# Altium schematic sheet ESP32.SchDoc: MCU & Display
size A4; Engineer: Jason Skells; SheetNumber: 2; SheetTotal: 4
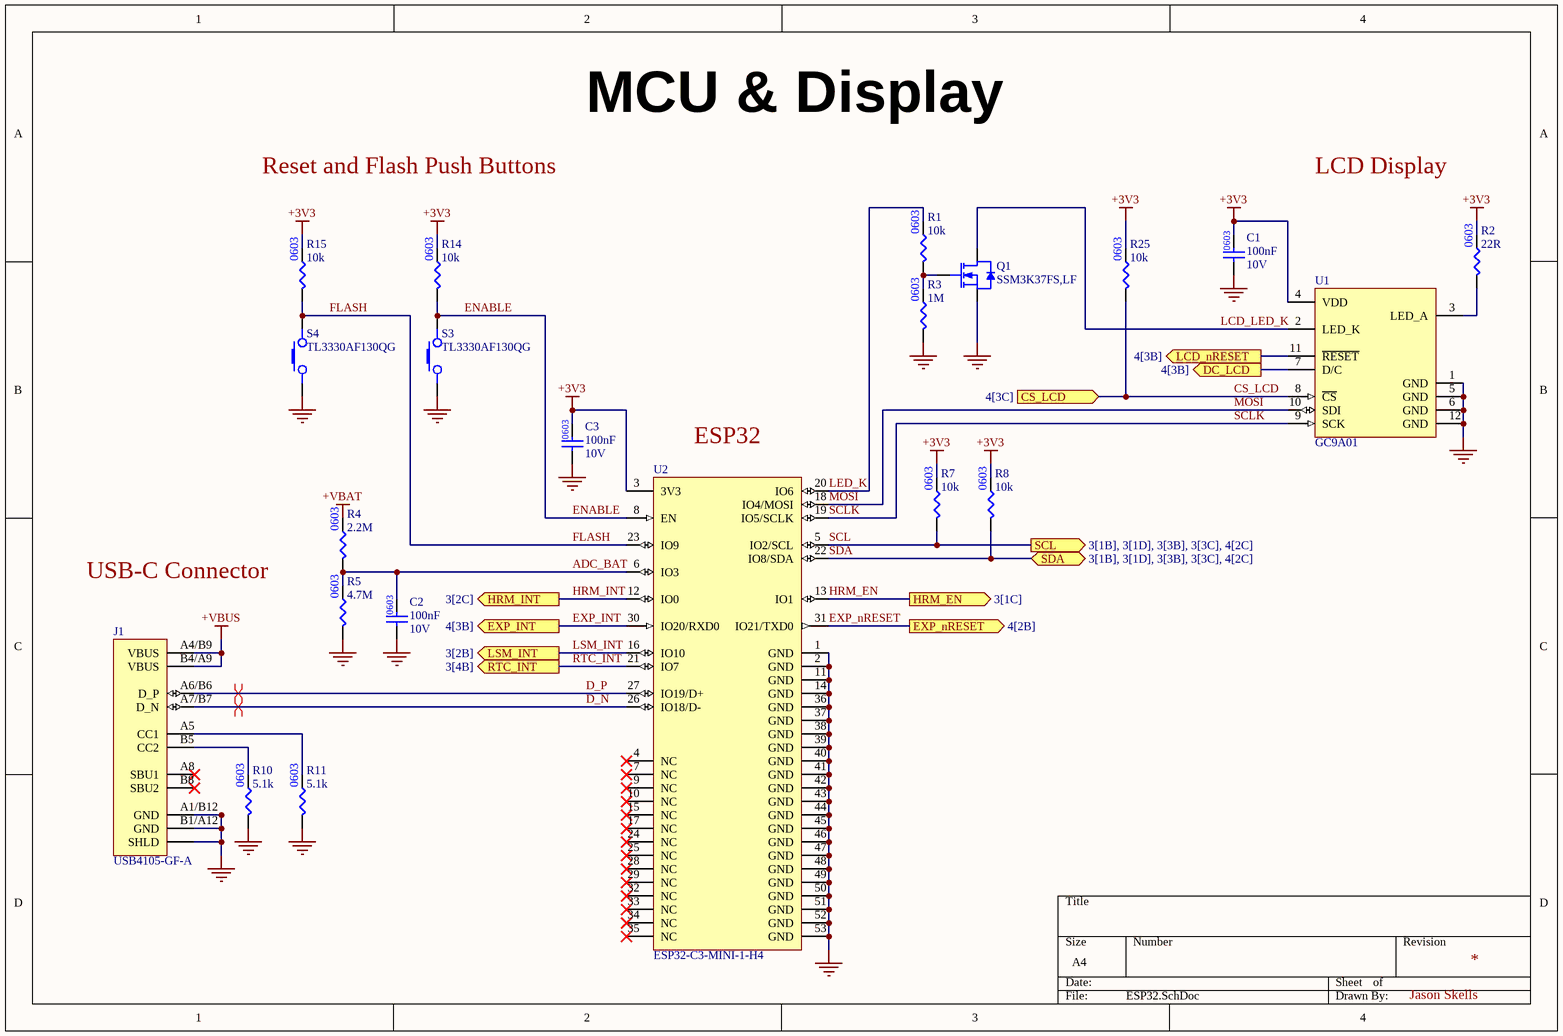
[diagram p0: ESP32.SchDoc]

## Parts
C1  Capacitance: 100nF  Voltage Rating: 10V  [CAP_0603]  (hidden comment: CC0603KRX7R6BB104)
C2  Capacitance: 100nF  Voltage Rating: 10V  [CAP_0603]  (hidden comment: CC0603KRX7R6BB104)
C3  Capacitance: 100nF  Voltage Rating: 10V  [CAP_0603]  (hidden comment: CC0603KRX7R6BB104)
J1  USB4105-GF-A  [USB4105-GF-A]
Q1  SSM3K37FS,LF  [SSM3K37FS,LF]
R1  Resistance: 10k  [RES_0603]  (hidden comment: RNCP0603FTD10K0)
R2  Resistance: 22R  [RES_0603]  (hidden comment: RC0603FR-0722RL)
R3  Resistance: 1M  [RES_0603]  (hidden comment: RC0603FR-071ML)
R4  Resistance: 2.2M  [RES_0603]  (hidden comment: RC0603FR-072M2L)
R5  Resistance: 4.7M  [RES_0603]  (hidden comment: RC0603FR-074M7L)
R7  Resistance: 10k  [RES_0603]  (hidden comment: RNCP0603FTD10K0)
R8  Resistance: 10k  [RES_0603]  (hidden comment: RNCP0603FTD10K0)
R10  Resistance: 5.1k  [RES_0603]  (hidden comment: RMCF0603FT5K10)
R11  Resistance: 5.1k  [RES_0603]  (hidden comment: RMCF0603FT5K10)
R14  Resistance: 10k  [RES_0603]  (hidden comment: RNCP0603FTD10K0)
R15  Resistance: 10k  [RES_0603]  (hidden comment: RNCP0603FTD10K0)
R25  Resistance: 10k  [RES_0603]  (hidden comment: RNCP0603FTD10K0)
S3  TL3330AF130QG  [TL3330AF130QG]
S4  TL3330AF130QG  [TL3330AF130QG]
U1  GC9A01  [GC9A01]
U2  ESP32-C3-MINI-1-H4  [ESP32-C3-MINI-1-H4]

## Ports
CS_LCD (in, see 4[3C]), DC_LCD (out, see 4[3B]), EXP_INT (out, see 4[3B]), EXP_nRESET (out, see 4[2B]), HRM_EN (out, see 3[1C]), HRM_INT (out, see 3[2C]), LCD_nRESET (out, see 4[3B]), LSM_INT (out, see 3[2B]), RTC_INT (out, see 3[4B]), SCL (out, see 3[1B], 3[1D], 3[3B], 3[3C], 4[2C]), SDA (bidir, see 3[1B], 3[1D], 3[3B], 3[3C], 4[2C])

## Nets
+3V3: C1.2 C3.2 R2.2 R7.2 R8.2 R14.2 R15.2 R25.2 U1.4(VDD) U2.3(3V3)
+VBAT: R4.2
+VBUS: J1.A4/B9(VBUS) J1.B4/A9(VBUS)
GND: C1.1 C2.1 C3.1 J1.A1/B12(GND) J1.B1/A12(GND) J1.SHLD Q1.3(Source) R3.1 R5.1 R10.1 R11.1 S3.2 S4.2 U1.1(GND) U1.5(GND) U1.6(GND) U1.12(GND) U2.1(GND) U2.2(GND) U2.11(GND) U2.14(GND) U2.36(GND) U2.37(GND) U2.38(GND) U2.39(GND) U2.40(GND) U2.41(GND) U2.42(GND) U2.43(GND) U2.44(GND) U2.45(GND) U2.46(GND) U2.47(GND) U2.48(GND) U2.49(GND) U2.50(GND) U2.51(GND) U2.52(GND) U2.53(GND)
ADC_BAT: C2.2 R4.1 R5.2 U2.6(IO3)
CS_LCD: R25.1 U1.8(~{CS}) ; port CS_LCD
D_N: J1.A7/B7(D_N) U2.26(IO18/D-)
D_P: J1.A6/B6(D_P) U2.27(IO19/D+)
DC_LCD: U1.7(D/C) ; port DC_LCD
ENABLE: R14.1 S3.1 U2.8(EN)
EXP_INT: U2.30(IO20/RXD0) ; port EXP_INT
EXP_nRESET: U2.31(IO21/TXD0) ; port EXP_nRESET
FLASH: R15.1 S4.1 U2.23(IO9)
HRM_EN: U2.13(IO1) ; port HRM_EN
HRM_INT: U2.12(IO0) ; port HRM_INT
LCD_LED_K: Q1.1(Drain) U1.2(LED_K)
LCD_nRESET: U1.11(~{RESET}) ; port LCD_nRESET
LED_K: R1.2 U2.20(IO6)
LSM_INT: U2.16(IO10) ; port LSM_INT
MOSI: U1.10(SDI) U2.18(IO4/MOSI)
RTC_INT: U2.21(IO7) ; port RTC_INT
SCL: R7.1 U2.5(IO2/SCL) ; port SCL
SCLK: U1.9(SCK) U2.19(IO5/SCLK)
SDA: R8.1 U2.22(IO8/SDA) ; port SDA
NetJ1_A5: J1.A5(CC1) R11.2
NetJ1_B5: J1.B5(CC2) R10.2
NetQ1_2: Q1.2(Gate) R1.1 R3.2
NetR2_1: R2.1 U1.3(LED_A)

Not connected (* = marked no-connect by the designer): J1 A8(SBU1)* B8(SBU2)*; U2 4(NC)* 7(NC)* 9(NC)* 10(NC)* 15(NC)* 17(NC)* 24(NC)* 25(NC)* 28(NC)* 29(NC)* 32(NC)* 33(NC)* 34(NC)* 35(NC)*

## Layout directives
differential pair: D_N, D_P

## Notes on the sheet
- Reset and Flash Push Buttons
- LCD Display
- (near U2) ESP32
- USB-C Connector

## Library data of the parts
C1-C3 = CC0603KRX7R6BB104: CAP CER 0.1UF 10V X7R 0603; Manufacturer: Yageo; Tolerance: 10%; Supplier 1: Digi-Key; Manufacturer Part Number: CC0603KRX7R6BB104; RoHS: Yes; Category: Ceramic Capacitors; Stock 1: 135167; Pricing 1: 1=0.11000, 10=0.07700, 50=0.04340, 100=0.03600, 500=0.02522, 1000=0.02089 (USD); Mount: Surface Mount; Case/Package: 0603; Case Code (Imperial): 0603; Case Code (Metric): 1608; Weight: 7.1E-05oz; Min Operating Temperature: -55°C; Max Operating Temperature: 125°C; Dielectric: X7R; Voltage Rating (DC): 10V; Packaging: Tape and Reel; Termination: SMD/SMT; Resistor Type: Ceramic; Series: CC; Construction: Flat; Length: 1.6mm; Width: 0.8mm; Height: 0.8mm; Thickness: 0.035inch; Depth: 0.8mm; Radiation Hardening: No; Lead Free: Lead Free; Halogen Free: Halogen Free; RoHS Compliant: Yes; ComponentLink1URL: https://datasheet.ciiva.com/11586/upy-gphc-x7r-6-3v-to-50v-8-11586327.pdf?src-supplier=Avnet; ComponentLink1Description: https://datasheet.ciiva.com/11586/upy-gphc-x7r-6-3v-to-50v-8-11586327.pdf?src-supplier=Avnet; Supplier Part Number 1: 311-4055-1-ND
J1 = USB4105-GF-A: Conn USB 2.0 Type C RCP 24 POS 0.3mm/0.5mm Solder RA SMD 24 Terminal 1 Port T/R; Manufacturer: Global Connector Technology; Supplier 1: Digi-Key; Manufacturer Part Number: USB4105-GF-A; RoHS: No; Category: USB Connectors; Supplier Part Number 1: 2073-USB4105-GF-ACT-ND
Q1 = SSM3K37FS,LF: MOSFET NCH 20V 200MA SSM; Manufacturer: Toshiba; Rds On Max: 2.2R; Input Capacitance: 12pF; Max Power Dissipation: 100mW; Supplier 1: Digi-Key; RoHS: Yes; Category: MOSFETs; Stock 1: 73760; Pricing 1: 1=0.25000, 10=0.20100, 100=0.10660, 500=0.07012, 1000=0.04768 (USD); Mount: Surface Mount; Packaging: Tape and Reel; Drain to Source Voltage (Vdss): 20V; Continuous Drain Current (ID): 200mA; ComponentLink1URL: https://toshiba.semicon-storage.com/info/docget.jsp?did=6172&prodName=SSM3K37FS&src-supplier=Digi-Key; ComponentLink1Description: https://toshiba.semicon-storage.com/info/docget.jsp?did=6172&prodName=SSM3K37FS&src-supplier=Digi-Key; Supplier Part Number 1: SSM3K37FSLFCT-ND; Manufacturer Part Number: SSM3K37FS,LF
R1 R7 R8 R14 R15 R25 = RNCP0603FTD10K0: Res Thin Film 0603 10K Ohm 1% 1/8W ±100ppm/°C Molded SMD SMD Paper T/R; Manufacturer: Stackpole Electronics; Max Power Dissipation: 125mW; Supplier 1: Digi-Key; Manufacturer Part Number: RNCP0603FTD10K0; RoHS: Yes; Category: Chip SMD Resistors; Stock 1: 2737524; Pricing 1: 1=0.10000, 10=0.06100, 100=0.02480, 1000=0.01113, 2500=0.00966 (USD); Mount: Surface Mount; Case/Package: 0603; Case Code (Metric): 1608; Case Code (Imperial): 0603; Contact Plating: Tin,Matte; Min Operating Temperature: -55°C; Max Operating Temperature: 155°C; Packaging: Tape and Reel; Tolerance: 1%; Resistor Type: Thin Film; Number of Terminations: 2; Temperature Coefficient: 100ppm/°C; Features: Moisture Resistant,Anti-Sulfur; Series: RNCP; Length: 0.059inch; Width: 0.031inch; Height: 0.02inch; Radiation Hardening: No; Lead Free: Lead Free; RoHS Compliant: Yes; ComponentLink1URL: https://www.seielect.com/Catalog/SEI-rncp.pdf?src-supplier=Avnet; ComponentLink1Description: https://www.seielect.com/Catalog/SEI-rncp.pdf?src-supplier=Avnet; ComponentLink2URL: https://www.seielect.com/Catalog/SEI-rncp.pdf?src-supplier=Digi-Key; ComponentLink2Description: https://www.seielect.com/Catalog/SEI-rncp.pdf?src-supplier=Digi-Key; ComponentLink3URL: https://www.seielect.com/catalog/SEI-Packaging.pdf?src-supplier=Digi-Key; ComponentLink3Description: https://www.seielect.com/catalog/SEI-Packaging.pdf?src-supplier=Digi-Key; Supplier Part Number 1: RNCP0603FTD10K0CT-ND
R2 = RC0603FR-0722RL: RES 22 OHM 1% 1/10W 0603; Manufacturer: Yageo; Temperature Coefficient: 100ppm/°C; Voltage Rating (DC): 50V; Power Rating: 100mW; Supplier 1: RSComponents; Manufacturer Part Number: RC0603FR-0722RL; RoHS: Yes; Category: Chip SMD Resistors; Stock 1: 10000; Pricing 1: 5000=0.00300, 10000=0.00300, 15000=0.00300, 20000=0.00300 (GBP); Case/Package: 0603; Number of Pins: 2; Case Code (Metric): 1608; Case Code (Imperial): 0603; Size Code: 0603; Min Operating Temperature: -55°C; Max Operating Temperature: 155°C; Tolerance: 1%; Resistor Type: Thick Film; Packaging: Tape and Reel; Voltage Rating: 50V; Package Quantity: 1; Number of Terminations: 2; Termination: SMD/SMT; Max Power Dissipation: 100mW; Features: Moisture Resistant; Series: RC; Resistance Tolerance: 1%; Technology: THICK FILM; Construction: Rectangular; Length: 1.6mm; Width: 0.031inch; Height: 0.022inch; Depth: 0.8mm; REACH SVHC: No SVHC; Lead Free: Lead Free; Military Standard: Not; RoHS Compliant: Yes; ComponentLink1URL: https://datasheet.ciiva.com/11819/0900766b80f96399-11819285.pdf?src-supplier=RSComponents; ComponentLink1Description: https://datasheet.ciiva.com/11819/0900766b80f96399-11819285.pdf?src-supplier=RSComponents; ComponentLink2URL: https://datasheet.ciiva.com/46395/443971-46395032.pdf?src-supplier=Element14; ComponentLink2Description: https://datasheet.ciiva.com/46395/443971-46395032.pdf?src-supplier=Element14; ComponentLink3URL: https://datasheet.ciiva.com/46440/1868787-46440901.pdf?src-supplier=Element14; ComponentLink3Description: https://datasheet.ciiva.com/46440/1868787-46440901.pdf?src-supplier=Element14; ComponentLink4URL: https://datasheet.ciiva.com/2454/pyu-r-int-thick-7-2454355.pdf?src-supplier=Digi-Key; ComponentLink4Description: https://datasheet.ciiva.com/2454/pyu-r-int-thick-7-2454355.pdf?src-supplier=Digi-Key; ComponentLink5URL: https://datasheet.ciiva.com/2454/pyu-r-int-thick-7-2454356.pdf?src-supplier=Digi-Key; ComponentLink5Description: https://datasheet.ciiva.com/2454/pyu-r-int-thick-7-2454356.pdf?src-supplier=Digi-Key; ComponentLink6URL: https://datasheet.ciiva.com/2454/pyu-r-int-thick-7-2454354.pdf?src-supplier=Digi-Key; ComponentLink6Description: https://datasheet.ciiva.com/2454/pyu-r-int-thick-7-2454354.pdf?src-supplier=Digi-Key; Supplier Part Number 1: 1995503
R3 = RC0603FR-071ML: RES 1M OHM 1% 1/10W 0603; Manufacturer: Yageo; Voltage Rating: 75V; Voltage Rating (DC): 50V; Power Rating: 100mW; Temperature Coefficient: 100ppm/°C; Application(s): HIGH RELIABILITY; Supplier 1: Digi-Key; Manufacturer Part Number: RC0603FR-071ML; RoHS: Yes; Category: Chip SMD Resistors; Stock 1: 2335859; Pricing 1: 1=0.10000, 10=0.02400, 100=0.00970, 1000=0.00436, 2500=0.00378 (USD); Case/Package: 0603; Number of Pins: 2; Case Code (Imperial): 0603; Case Code (Metric): 1608; Weight: 0.000847oz; Min Operating Temperature: -55°C; Max Operating Temperature: 155°C; Tolerance: 1%; Packaging: Cut Tape; Package Quantity: 5000; Termination: SMD/SMT; Resistor Type: Thick Film; Type: General Purpose; Series: RC; Technology: THICK FILM; Length: 1.6mm; Width: 0.8mm; Height: 0.45mm; Depth: 0.8mm; RoHS Compliant: Yes; REACH SVHC: No SVHC; Military Standard: Not; Lead Free: Lead Free; ComponentLink1URL: https://datasheet.ciiva.com/11819/0900766b80f96399-11819295.pdf?src-supplier=RSComponents; ComponentLink1Description: https://datasheet.ciiva.com/11819/0900766b80f96399-11819295.pdf?src-supplier=RSComponents; ComponentLink2URL: https://datasheet.ciiva.com/7983/443971-7983614.pdf?src-supplier=Element14; ComponentLink2Description: https://datasheet.ciiva.com/7983/443971-7983614.pdf?src-supplier=Element14; ComponentLink3URL: https://datasheet.ciiva.com/12555/rc0603-272842-12555388.pdf?src-supplier=Mouser; ComponentLink3Description: https://datasheet.ciiva.com/12555/rc0603-272842-12555388.pdf?src-supplier=Mouser; Supplier Part Number 1: 311-1.00MHRCT-ND
R4 = RC0603FR-072M2L: RES SMD 2.2M OHM 1% 1/10W 0603; Manufacturer: Yageo; Voltage Rating (DC): 50V; Power Rating: 100mW; Temperature Coefficient: 100ppm/°C; Supplier 1: Digi-Key; Manufacturer Part Number: RC0603FR-072M2L; RoHS: Yes; Category: Chip SMD Resistors; Stock 1: 189008; Pricing 1: 1=0.10000, 10=0.02400, 100=0.00970, 1000=0.00436, 2500=0.00378 (USD); Case/Package: 0603; Number of Pins: 2; Case Code (Imperial): 0603; Case Code (Metric): 1608; Size Code: 0603; Min Operating Temperature: -55°C; Max Operating Temperature: 155°C; Packaging: Tape and Reel; Tolerance: 1%; Voltage Rating: 50V; Package Quantity: 5000; Resistor Type: Thick Film; Number of Terminations: 2; Termination: SMD/SMT; Max Power Dissipation: 100mW; Features: Moisture Resistant; Series: RC; Resistance Tolerance: 1%; Technology: THICK FILM; Length: 1.6mm; Width: 0.8mm; Height: 0.45mm; Depth: 0.8mm; REACH SVHC: No SVHC; Lead Free: Lead Free; RoHS Compliant: Yes; ComponentLink1URL: https://datasheet.ciiva.com/11808/0900766b80f96399-11808742.pdf?src-supplier=RSComponents; ComponentLink1Description: https://datasheet.ciiva.com/11808/0900766b80f96399-11808742.pdf?src-supplier=RSComponents; ComponentLink2URL: https://datasheet.ciiva.com/46440/1868787-46440903.pdf?src-supplier=Element14; ComponentLink2Description: https://datasheet.ciiva.com/46440/1868787-46440903.pdf?src-supplier=Element14; ComponentLink3URL: https://datasheet.ciiva.com/12558/rc0603-272842-12558598.pdf?src-supplier=Mouser; ComponentLink3Description: https://datasheet.ciiva.com/12558/rc0603-272842-12558598.pdf?src-supplier=Mouser; ComponentLink4URL: https://datasheet.ciiva.com/7746/443971-7746319.pdf?src-supplier=Element14; ComponentLink4Description: https://datasheet.ciiva.com/7746/443971-7746319.pdf?src-supplier=Element14; Supplier Part Number 1: YAG3329CT-ND
R5 = RC0603FR-074M7L: RES 4.7M OHM 1% 1/10W 0603; Manufacturer: Yageo; Temperature Coefficient: 100ppm/°C; Power Rating: 100mW; Voltage Rating: 50V; Supplier 1: Digi-Key; Manufacturer Part Number: RC0603FR-074M7L; RoHS: Yes; Category: Chip SMD Resistors; Stock 1: 424983; Pricing 1: 1=0.10000, 10=0.02400, 100=0.00970, 1000=0.00436, 2500=0.00378 (USD); Case/Package: 0603; Number of Pins: 2; Case Code (Imperial): 0603; Case Code (Metric): 1608; Size Code: 0603; Min Operating Temperature: -55°C; Max Operating Temperature: 155°C; Tolerance: 1%; Packaging: Tape and Reel; Voltage Rating (DC): 50V; Termination: SMD/SMT; Resistor Type: Thick Film; Features: Moisture Resistant; Series: RC; Max Power Dissipation: 100mW; Number of Terminations: 2; Resistance Tolerance: 1%; Technology: THICK FILM; Construction: Rectangular; Length: 1.6mm; Width: 0.8mm; Height: 0.45mm; Depth: 0.8mm; RoHS Compliant: Yes; REACH SVHC: No SVHC; Military Standard: Not; Lead Free: Lead Free; ComponentLink1URL: https://datasheet.ciiva.com/11819/0900766b80f96399-11819362.pdf?src-supplier=RSComponents; ComponentLink1Description: https://datasheet.ciiva.com/11819/0900766b80f96399-11819362.pdf?src-supplier=RSComponents; ComponentLink2URL: https://datasheet.ciiva.com/7746/443971-7746367.pdf?src-supplier=Element14; ComponentLink2Description: https://datasheet.ciiva.com/7746/443971-7746367.pdf?src-supplier=Element14; ComponentLink3URL: https://datasheet.ciiva.com/15189/getdatasheetpartid-328863-15189765.pdf?src-supplier=Verical; ComponentLink3Description: https://datasheet.ciiva.com/15189/getdatasheetpartid-328863-15189765.pdf?src-supplier=Verical; Supplier Part Number 1: 311-4.70MHRCT-ND
R10 R11 = RMCF0603FT5K10: Res Thick Film 0603 5.1K Ohm 1% 0.1W(1/10W) ±100ppm/C Pad SMD Automotive T/R; Manufacturer: Stackpole Electronics; Max Power Dissipation: 100mW; Temperature Coefficient: 100ppm/°C; Supplier 1: Digi-Key; Manufacturer Part Number: RMCF0603FT5K10; RoHS: Yes; Category: Chip SMD Resistors; Stock 1: 1237364; Pricing 1: 1=0.10000, 10=0.01700, 100=0.00680, 1000=0.00305, 2500=0.00264 (USD); Mount: Surface Mount; Case/Package: 0603; Case Code (Metric): 1608; Case Code (Imperial): 0603; Contact Plating: Tin,Matte; Min Operating Temperature: -55°C; Max Operating Temperature: 155°C; Tolerance: 1%; Packaging: Tape and Reel; Resistor Type: Thick Film; Number of Terminations: 2; Features: Automotive AEC-Q200; Series: RMCF; Length: 0.061inch; Width: 0.031inch; Height: 0.022inch; Radiation Hardening: No; RoHS Compliant: Yes; ComponentLink1URL: http://components.arrow.com/part/dataview/50863347S9465827N1174?src-supplier=Arrow+Electronics; ComponentLink1Description: http://components.arrow.com/part/dataview/50863347S9465827N1174?src-supplier=Arrow+Electronics; ComponentLink2URL: https://www.seielect.com/catalog/SEI-RMCF_RMCP.pdf?src-supplier=Avnet; ComponentLink2Description: https://www.seielect.com/catalog/SEI-RMCF_RMCP.pdf?src-supplier=Avnet; ComponentLink3URL: https://www.seielect.com/catalog/SEI-Packaging.pdf?src-supplier=Digi-Key; ComponentLink3Description: https://www.seielect.com/catalog/SEI-Packaging.pdf?src-supplier=Digi-Key; Supplier Part Number 1: RMCF0603FT5K10CT-ND
S3 S4 = TL3330AF130QG: Switch Tactile N.O. SPST Rectangular Button Gull Wing 0.05A 12VDC 50000Cycles 1.27N SMD T/R; Manufacturer: E-Switch; Actuator Material: Nylon,Polyamide; Operating Force: 130gf; Illumination Type: Non-Illuminated,Illuminated; Switch Travel: 0.25mm; Switch Function: Off-Mom; Voltage Rating (DC): 12V; Contact Resistance: 100mR; Current Rating: 50mA; Actuator Length: 1mm; Supplier 1: Digi-Key; RoHS: Yes; Category: Tactile Switches; Stock 1: 42241; Pricing 1: 1=0.51000, 10=0.48800, 25=0.47000, 100=0.40680, 250=0.37060, 500=0.34350, 1000=0.30734 (USD); Mount: Surface Mount; Case/Package: SMD/SMT; Contact Plating: Silver; Mechanical Life: 50000Cycles; Contact Material: Silver; Color: Black; Min Operating Temperature: -30°C; Max Operating Temperature: 70°C; Package Quantity: 1; Packaging: Tape and Reel; Throw Configuration: SPST; Termination: Gull Wing; Orientation: Right Angle; Series: TL3330; Max Voltage Rating (DC): 12V; Electrical Life: 50000Cycles; Size: 5.3mm; Lead Free: Lead Free; REACH SVHC: No SVHC; RoHS Compliant: Yes; ComponentLink1URL: https://datasheet.ciiva.com/2900/p010950-2900785.pdf?src-supplier=Digi-Key; ComponentLink1Description: https://datasheet.ciiva.com/2900/p010950-2900785.pdf?src-supplier=Digi-Key; ComponentLink2URL: https://datasheet.ciiva.com/23713/tl3330-23713381.pdf?src-supplier=Newark; ComponentLink2Description: https://datasheet.ciiva.com/23713/tl3330-23713381.pdf?src-supplier=Newark; ComponentLink3URL: https://datasheet.ciiva.com/2900/p010950-2900786.pdf?src-supplier=Digi-Key; ComponentLink3Description: https://datasheet.ciiva.com/2900/p010950-2900786.pdf?src-supplier=Digi-Key; ComponentLink4URL: https://datasheet.ciiva.com/2900/p010950-2900787.pdf?src-supplier=Digi-Key; ComponentLink4Description: https://datasheet.ciiva.com/2900/p010950-2900787.pdf?src-supplier=Digi-Key; Supplier Part Number 1: EG4388CT-ND; Manufacturer Part Number: TL3330AF130QG
U1 = GC9A01: GC9A01 LCD Display
U2 = ESP32-C3-MINI-1-H4: SMD Module, ESP32-C3FH4, Pcb Ant; Manufacturer: Espressif Systems; Supplier 1: Digi-Key; Manufacturer Part Number: ESP32-C3-MINI-1-H4; RoHS: No; Stock 1: 1970; Pricing 1: 1=1.95000 (USD); Supplier Part Number 1: 1965-ESP32-C3-MINI-1-H4CT-ND